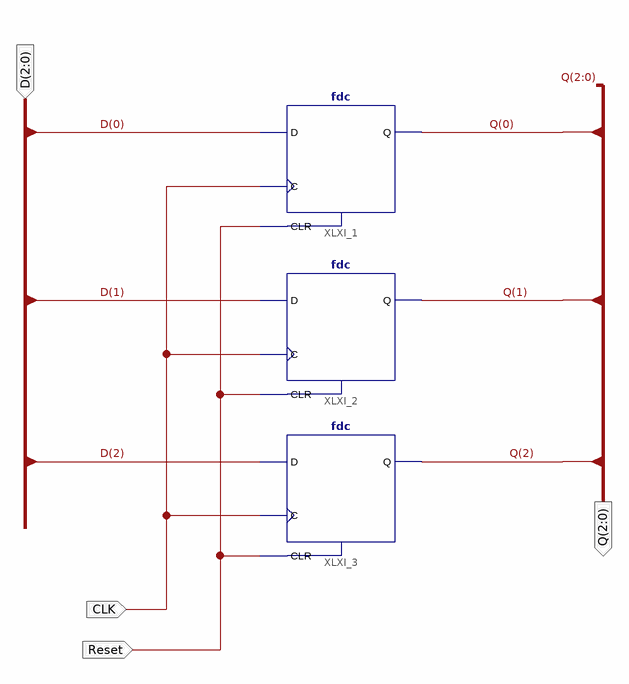
[diagram p0: schematic sheet 1]
// Xilinx ISE schematic Register_3_bit.sch (spartan3e) as structural Verilog: 3 symbols, 4 ports
module Register_3_bit (
  input  Reset,
  input  CLK,
  input  [2:0] D,
  output [2:0] Q
);

  fdc XLXI_1 (.C(CLK), .CLR(Reset), .D(D[0]), .Q(Q[0]));
  fdc XLXI_2 (.C(CLK), .CLR(Reset), .D(D[1]), .Q(Q[1]));
  fdc XLXI_3 (.C(CLK), .CLR(Reset), .D(D[2]), .Q(Q[2]));
endmodule
